# EAGLE design LB_w10_INVERTER_v03(rev1) (EAGLE 6.6.0)
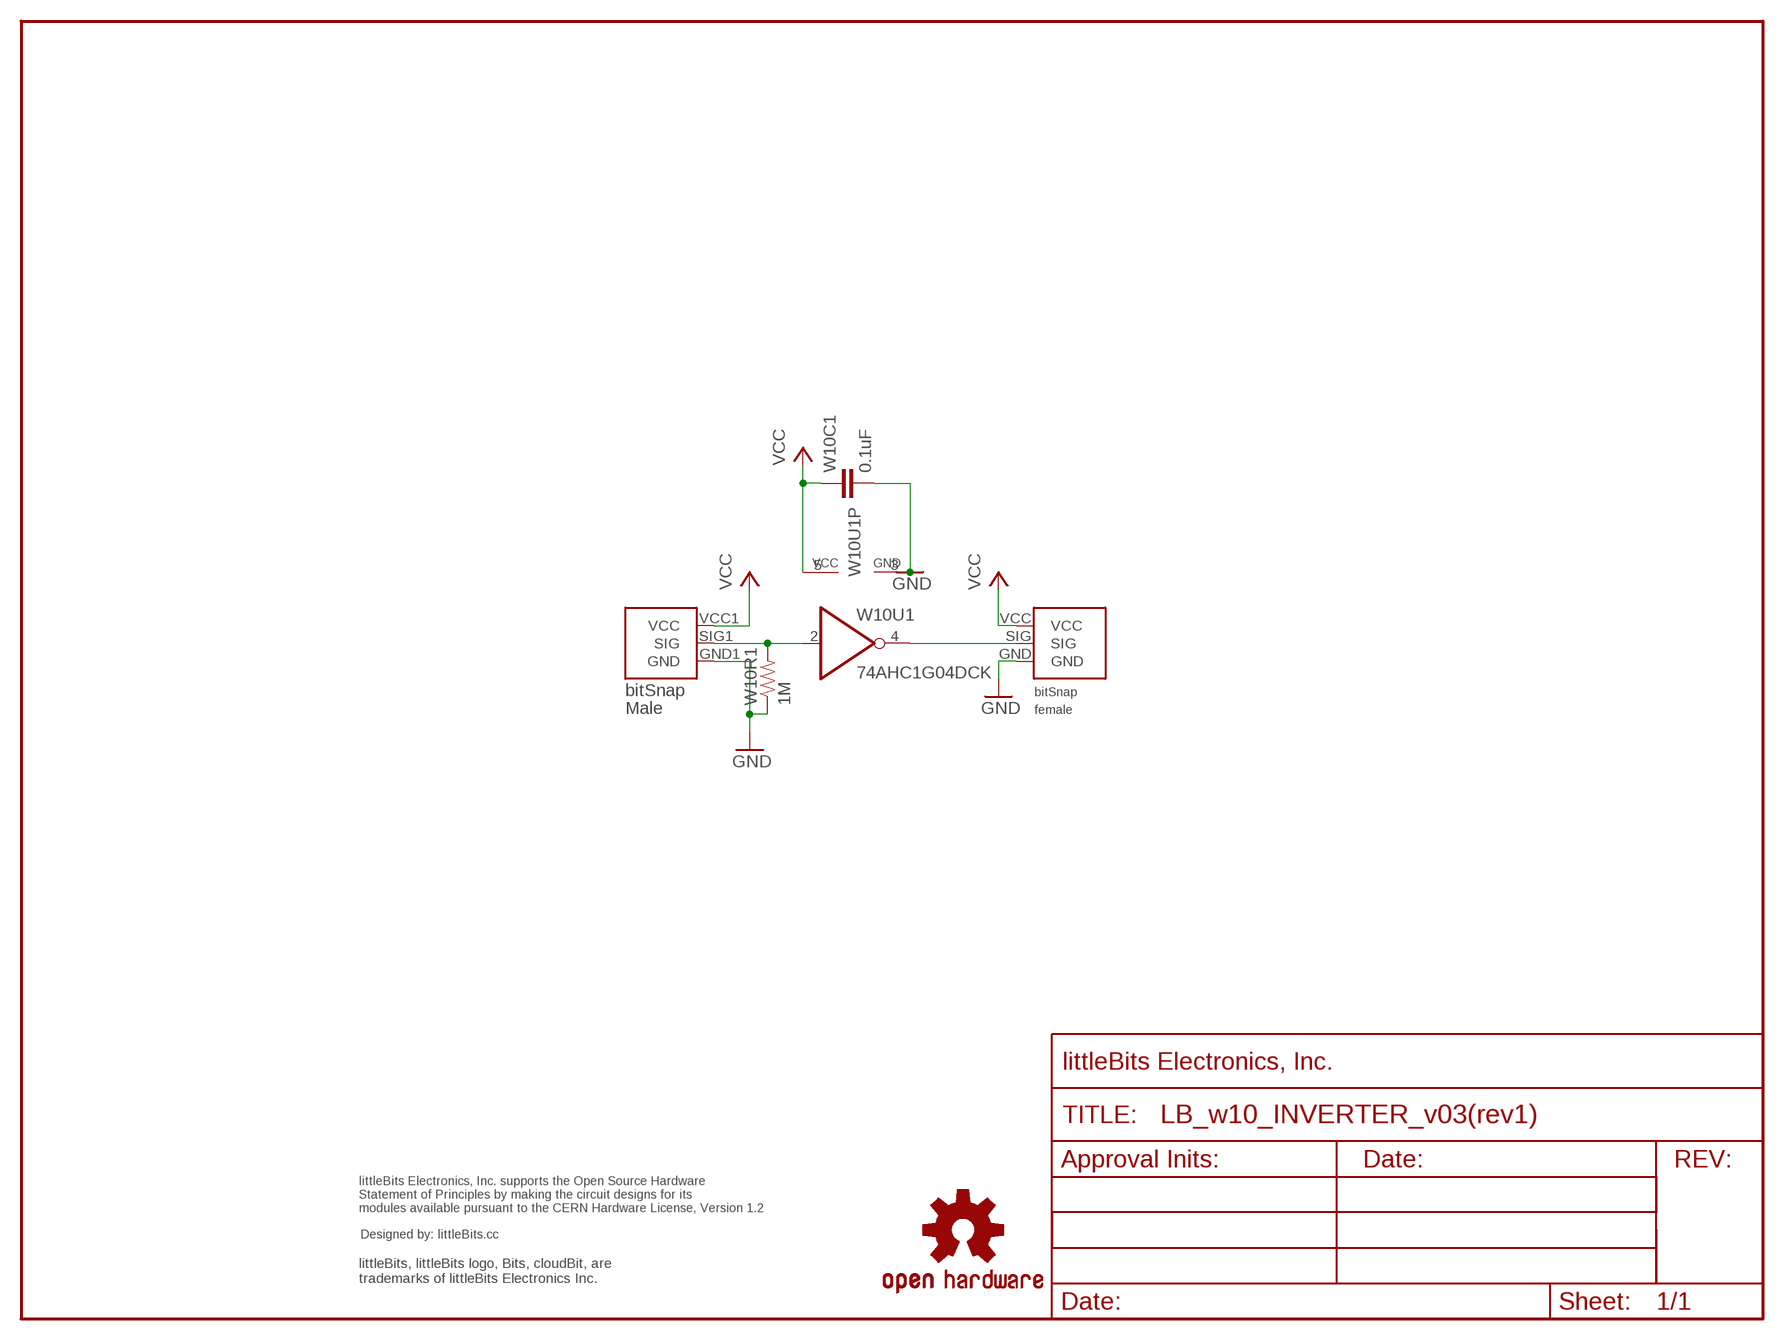
[diagram p0: schematic, sheet 1]

## Parts
U$1  FRAME-LETTER-OHWOHW  [FABDWG01-OHW]
U$3  OSHWCREDIT  [OSHWCREDIT]
U$4  OSHW-LOGOL  [OSHW-LOGO-L]
W10BSF1  BITSNAP_V03_FEMALE  [BITSNAP_V03_FEMALE]
W10BSM1  BITSNAP_V03_MALE  [BITSNAP_V03_MALE]
W10C1  0.1uF  CAP0603-CAP  [0603-CAP]
W10R1  1M  RESISTOR0603-RES  [0603-RES]
W10U1  74AHC1G04DCK  [SC70-5]

## Nets
GND: W10BSF1.GND W10BSM1.GND1(GND) W10C1.2 W10R1.1 W10U1.3(GND)
N$1: W10BSM1.SIG1(SIG) W10R1.2 W10U1.2(I)
N$2: W10BSF1.SIG W10U1.4(O)
VCC: W10BSF1.VCC W10BSM1.VCC1(VCC) W10C1.1 W10U1.5(VCC)

## Library data of the parts
U$1 = LITTLEBITS:FRAME-LETTER-OHW
U$3 = LITTLEBITS:OSHWCREDIT
U$4 = SparkFun_NEW:OSHW-LOGO: Open Source Hardware Logo This logo indicates the piece of hardware it is found on incorporates a OSHW license and/or adheres to the definition of open source hardware found here: http://freedomdefined.org/OSHW
W10BSF1 = bitSnap:BITSNAP_V03_FEMALE
W10BSM1 = bitSnap:BITSNAP_V03_MALE
W10C1 = SparkFun:CAP: Capacitor Standard 0603 ceramic capacitor, and 0.1" leaded capacitor.
W10R1 = SparkFun:RESISTOR: Resistor Basic schematic elements and footprints for 0603, 1206, and PTH resistors.
W10U1 = 74xx-little-de:74*1G04: INVERTER Gate

## Board
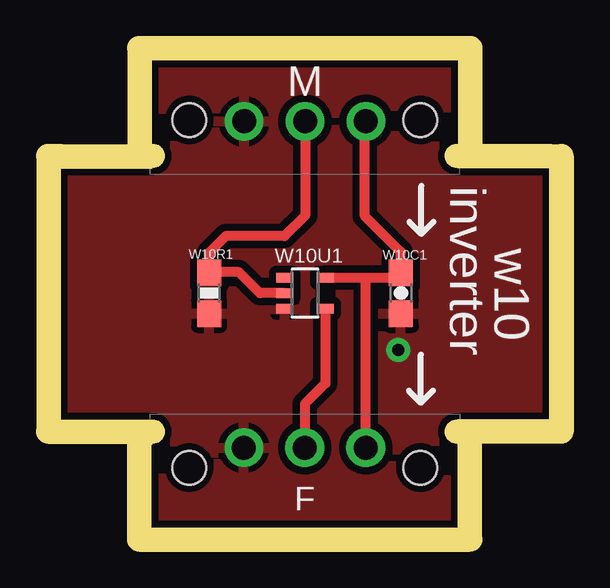
[diagram p1: board, top side]
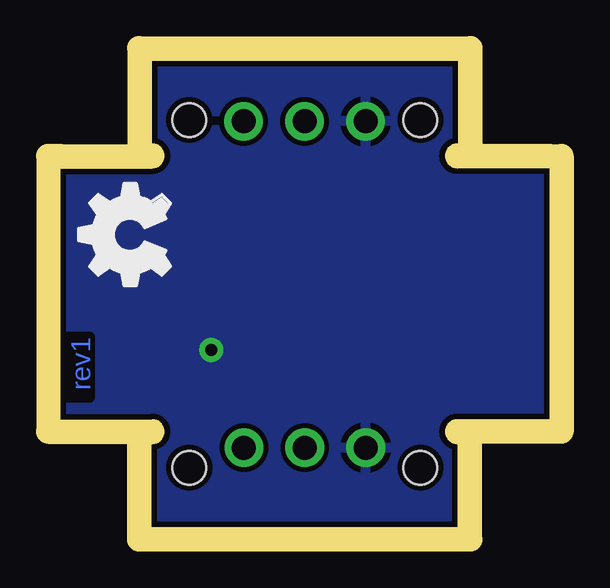
[diagram p2: board, bottom side, seen from below]

Size 20.4 x 19.5 mm. Coordinates in mm from the lower left corner, seen from the top.
Outline: 0,15 0,4.5
Outline: 20.4,4.5 20.4,15
Copper layers (1*16): Top 0.035mm / dielectric 1.5mm / Bottom 0.035mm
Design rules "default": minimum track width 8mil, minimum drill 20mil, track to track 8mil, track to pad 8mil, pad to pad 8mil, via to via 8mil, smd to smd 8mil, copper to edge 10mil, drill to drill 8mil, minimum pad ring 12mil, minimum via ring 10mil, stop-mask expansion 4mil, vias tented up to drill 25mil, thermal gap 10mil
Milling: 6 lines

### Footprints (pad centres in the part's own frame; a part is rotated, then mirrored left to right if it is on the bottom)
BITSNAP_V03_FEMALE = drill 1: GND 3.91,3.33; SIG 6.45,3.33; VCC 8.99,3.33 | hole 1.4: 1.63,2.5; 11.27,2.5
BITSNAP_V03_MALE = drill 1: GND1 8.98,2.56; SIG1 6.44,2.56; VCC1 3.9,2.56 | hole 1.4: 11.27,2.5; 1.63,2.5
0603-CAP = smd 1.1 x 1: 1 -0.85,0; 2 0.85,0
0603-RES = smd 1.1 x 1: 1 -0.85,0; 2 0.85,0
SC70-5 = smd 0.4 x 0.7: 1 -0.65,-0.85; 2 0,-0.85; 3 0.65,-0.85; 4 0.65,0.85; 5 -0.65,0.85

### Placement (x,y rotation side)
U$1  0,0 0 top
U$2  [OSHW_FILLX150_NOTEXT]  15.8,9.26 0 top
U$3  -91,-64.65 0 top  (outside the outline)
U$4  -30.8,-69.14 0 top  (outside the outline)
W10BSF1  3.75,0 0 top
W10BSM1  16.65,19.5 180 top
W10C1  14.21,9.78 270 top
W10R1  6.21,9.78 90 top
W10U1  10.21,9.78 270 top

### Tracks (layer width: path | path; a pad name or v marks a point on that pad's centre or on a via)
GND  (via drill 0.5)
  other vias: 14.1,7.4
  pour Top (isolate 0.305): 0.25,19.25 20.17,19.25 20.17,0.25 0.25,0.25
  pour Bottom: 0.25,19.25 20.17,19.25 20.17,0.25 0.25,0.25
N$1
  Top 0.406: W10U1.2 8.32,9.78 7.45,10.65 6.24,10.65 W10R1.2 6.2,10.64 6.2,11.45 6.9,12.15 9.35,12.15 10.21,13.01 W10BSM1.SIG1
N$2
  Top 0.406: W10U1.4 11.06,6.01 10.2,5.15 W10BSF1.SIG
VCC
  Top 0.406: W10U1.5 12.6,10.43 | 12.6,10.43 14.01,10.43 W10C1.1 14.21,11.49 12.7,13 12.7,16.99 W10BSM1.VCC1 | W10BSF1.VCC 12.74,10.29 12.6,10.43

### Text on the board
Bottom: rev1
tPlace: inverter | w10
Reference: SMALL